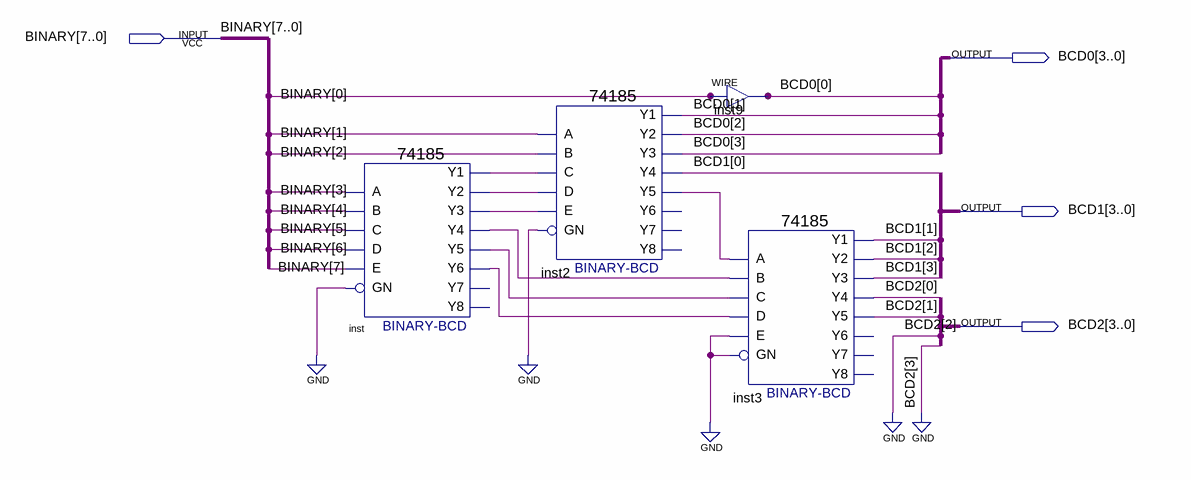
[diagram p0: schematic sheet]
// Quartus schematic bin2bcd.bdf as structural Verilog: 4 symbols, 4 pins
module bin2bcd (
  input  [7:0] BINARY,
  output [3:0] BCD0,
  output [3:0] BCD1,
  output [3:0] BCD2
);

  wire inst2_y5, inst_y1, inst_y2, inst_y3, inst_y4, inst_y5, inst_y6;

  \74185  inst (
    .A(BINARY[3]), .B(BINARY[4]), .D(BINARY[6]), .C(BINARY[5]), .E(BINARY[7]), .GN(1'b0), .Y1(inst_y1),
    .Y3(inst_y3), .Y2(inst_y2), .Y5(inst_y5), .Y4(inst_y4), .Y6(inst_y6));  // open: Y8, Y7
  \74185  inst2 (
    .A(BINARY[1]), .B(BINARY[2]), .D(inst_y2), .C(inst_y1), .E(inst_y3), .GN(1'b0), .Y1(BCD0[1]),
    .Y3(BCD0[3]), .Y2(BCD0[2]), .Y5(inst2_y5), .Y4(BCD1[0]));  // open: Y6, Y8, Y7
  assign BCD0[0] = BINARY[0];  // WIRE inst9
  \74185  inst3 (
    .A(inst2_y5), .B(inst_y4), .D(inst_y6), .C(inst_y5), .E(1'b0), .GN(1'b0), .Y1(BCD1[1]), .Y3(BCD1[3]),
    .Y2(BCD1[2]), .Y5(BCD2[1]), .Y4(BCD2[0]));  // open: Y6, Y8, Y7

  assign BCD2[3:2] = 2'b00;
endmodule
